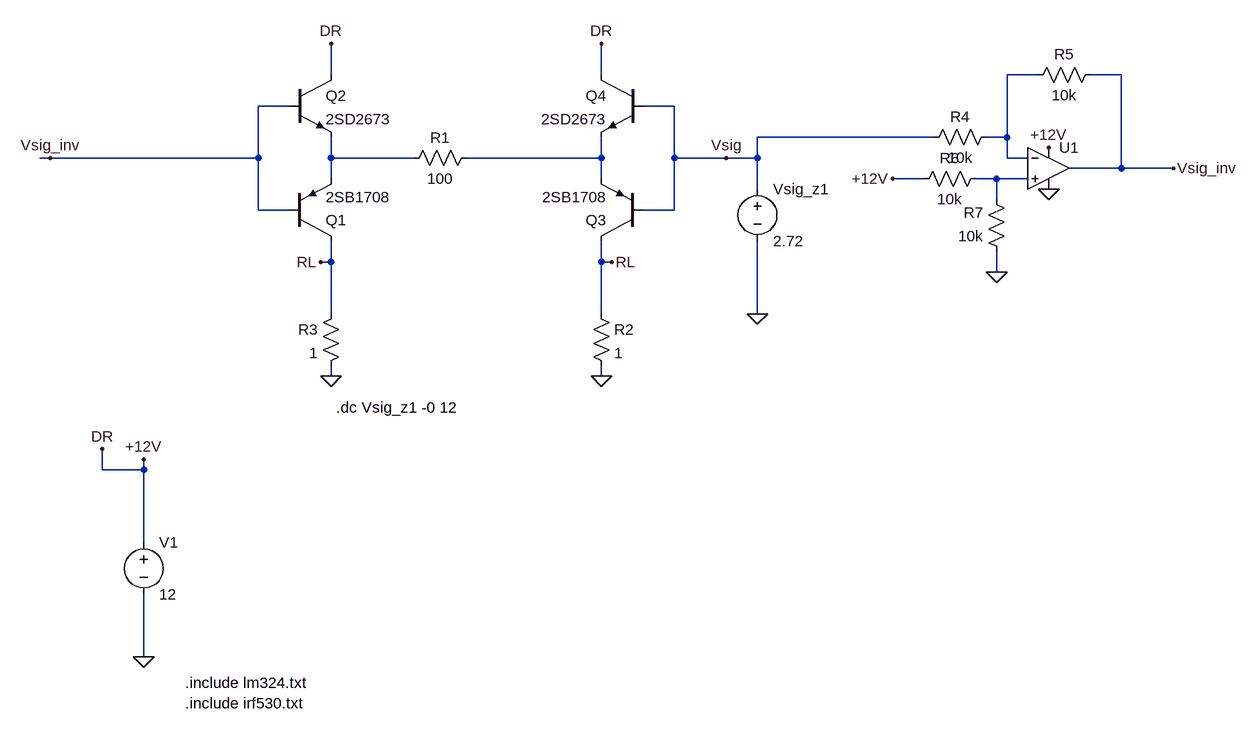
[diagram p0: schematic PushPull.asc]
PushPull.asc, the LTspice schematic file:
Version 4
SHEET 1 1060 1044
WIRE -352 64 -352 16
WIRE 64 64 64 16
WIRE 736 64 688 64
WIRE 864 64 816 64
WIRE -416 112 -464 112
WIRE 176 112 128 112
WIRE 576 160 304 160
WIRE 688 160 688 64
WIRE 688 160 656 160
WIRE -784 192 -800 192
WIRE -464 192 -464 112
WIRE -464 192 -784 192
WIRE -352 192 -352 160
WIRE -224 192 -352 192
WIRE 64 192 64 160
WIRE 64 192 -144 192
WIRE 176 192 176 112
WIRE 256 192 176 192
WIRE 304 192 304 160
WIRE 304 192 256 192
WIRE 688 192 688 160
WIRE 720 192 688 192
WIRE 864 208 864 64
WIRE 864 208 784 208
WIRE 944 208 864 208
WIRE -352 224 -352 192
WIRE 64 224 64 192
WIRE 560 224 512 224
WIRE 672 224 640 224
WIRE 720 224 672 224
WIRE 304 240 304 192
WIRE 672 256 672 224
WIRE -464 272 -464 192
WIRE -416 272 -464 272
WIRE 176 272 176 192
WIRE 176 272 128 272
WIRE -352 352 -352 320
WIRE -352 352 -368 352
WIRE 64 352 64 320
WIRE 80 352 64 352
WIRE 672 368 672 336
WIRE -352 432 -352 352
WIRE 64 432 64 352
WIRE 304 432 304 320
WIRE -352 528 -352 512
WIRE 64 528 64 512
WIRE -704 672 -704 640
WIRE -640 672 -640 656
WIRE -640 672 -704 672
WIRE -640 784 -640 672
WIRE -640 960 -640 864
FLAG -640 656 +12V
FLAG -640 960 0
FLAG -704 640 DR
FLAG 304 432 0
FLAG 64 528 0
FLAG 64 16 DR
FLAG 80 352 RL
FLAG -352 528 0
FLAG -352 16 DR
FLAG -368 352 RL
FLAG 256 192 Vsig
FLAG 512 224 +12V
FLAG 752 176 +12V
FLAG 752 240 0
FLAG 672 368 0
FLAG 944 208 Vsig_inv
FLAG -784 192 Vsig_inv
SYMBOL voltage -640 768 R0
WINDOW 123 0 0 Left 0
WINDOW 39 0 0 Left 0
SYMATTR InstName V1
SYMATTR Value 12
SYMBOL voltage 304 224 R0
WINDOW 123 0 0 Left 0
WINDOW 39 0 0 Left 0
SYMATTR InstName Vsig_z1
SYMATTR Value 2.72
SYMBOL pnp 128 320 R180
SYMATTR InstName Q3
SYMATTR Value 2SB1708
SYMBOL npn 128 64 M0
SYMATTR InstName Q4
SYMATTR Value 2SD2673
SYMBOL res -128 176 R90
WINDOW 0 0 56 VBottom 2
WINDOW 3 32 56 VTop 2
SYMATTR InstName R1
SYMATTR Value 100
SYMBOL res 48 416 R0
SYMATTR InstName R2
SYMATTR Value 1
SYMBOL pnp -416 320 M180
SYMATTR InstName Q1
SYMATTR Value 2SB1708
SYMBOL npn -416 64 R0
SYMATTR InstName Q2
SYMATTR Value 2SD2673
SYMBOL res -336 416 M0
SYMATTR InstName R3
SYMATTR Value 1
SYMBOL OpAmps\\UniversalOpAmp2 752 208 R0
SYMATTR InstName U1
SYMBOL res 672 144 R90
WINDOW 0 0 56 VBottom 2
WINDOW 3 32 56 VTop 2
SYMATTR InstName R4
SYMATTR Value 10k
SYMBOL res 832 48 R90
WINDOW 0 0 56 VBottom 2
WINDOW 3 32 56 VTop 2
SYMATTR InstName R5
SYMATTR Value 10k
SYMBOL res 656 208 R90
WINDOW 0 0 56 VBottom 2
WINDOW 3 32 56 VTop 2
SYMATTR InstName R6
SYMATTR Value 10k
SYMBOL res 688 352 R180
WINDOW 0 36 76 Left 2
WINDOW 3 36 40 Left 2
SYMATTR InstName R7
SYMATTR Value 10k
TEXT -344 576 Left 2 !.dc Vsig_z1 -0 12
TEXT -576 1000 Left 2 !.include lm324.txt\n.include irf530.txt

The netlist it stands for:
* PushPull.asc
V1 DR 0 12
Vsig_z1 Vsig 0 2.72
Q3 RL Vsig N003 0 2SB1708
Q4 DR Vsig N003 0 2SD2673
R1 N003 N002 100
R2 RL 0 1
Q1 RL Vsig_inv N002 0 2SB1708
Q2 DR Vsig_inv N002 0 2SD2673
R3 RL 0 1
XU1 N004 N001 DR 0 Vsig_inv level2 Avol=1Meg GBW=10Meg Slew=10Meg Ilimit=25m Rail=0 Vos=0 En=0 Enk=0 In=0 Ink=0 Rin=500Meg  ; pins In+ In- V+ V- OUT
R4 N001 Vsig 10k
R5 Vsig_inv N001 10k
R6 N004 DR 10k
R7 0 N004 10k
.model NPN NPN
.model PNP PNP
.lib standard.bjt
.dc Vsig_z1 -0 12
.include lm324.txt
.include irf530.txt
.lib UniversalOpAmp2.lib
.backanno
.end